# Altium schematic sheet Connector.SchDoc
size A4; SheetNumber: 5; SheetTotal: 4
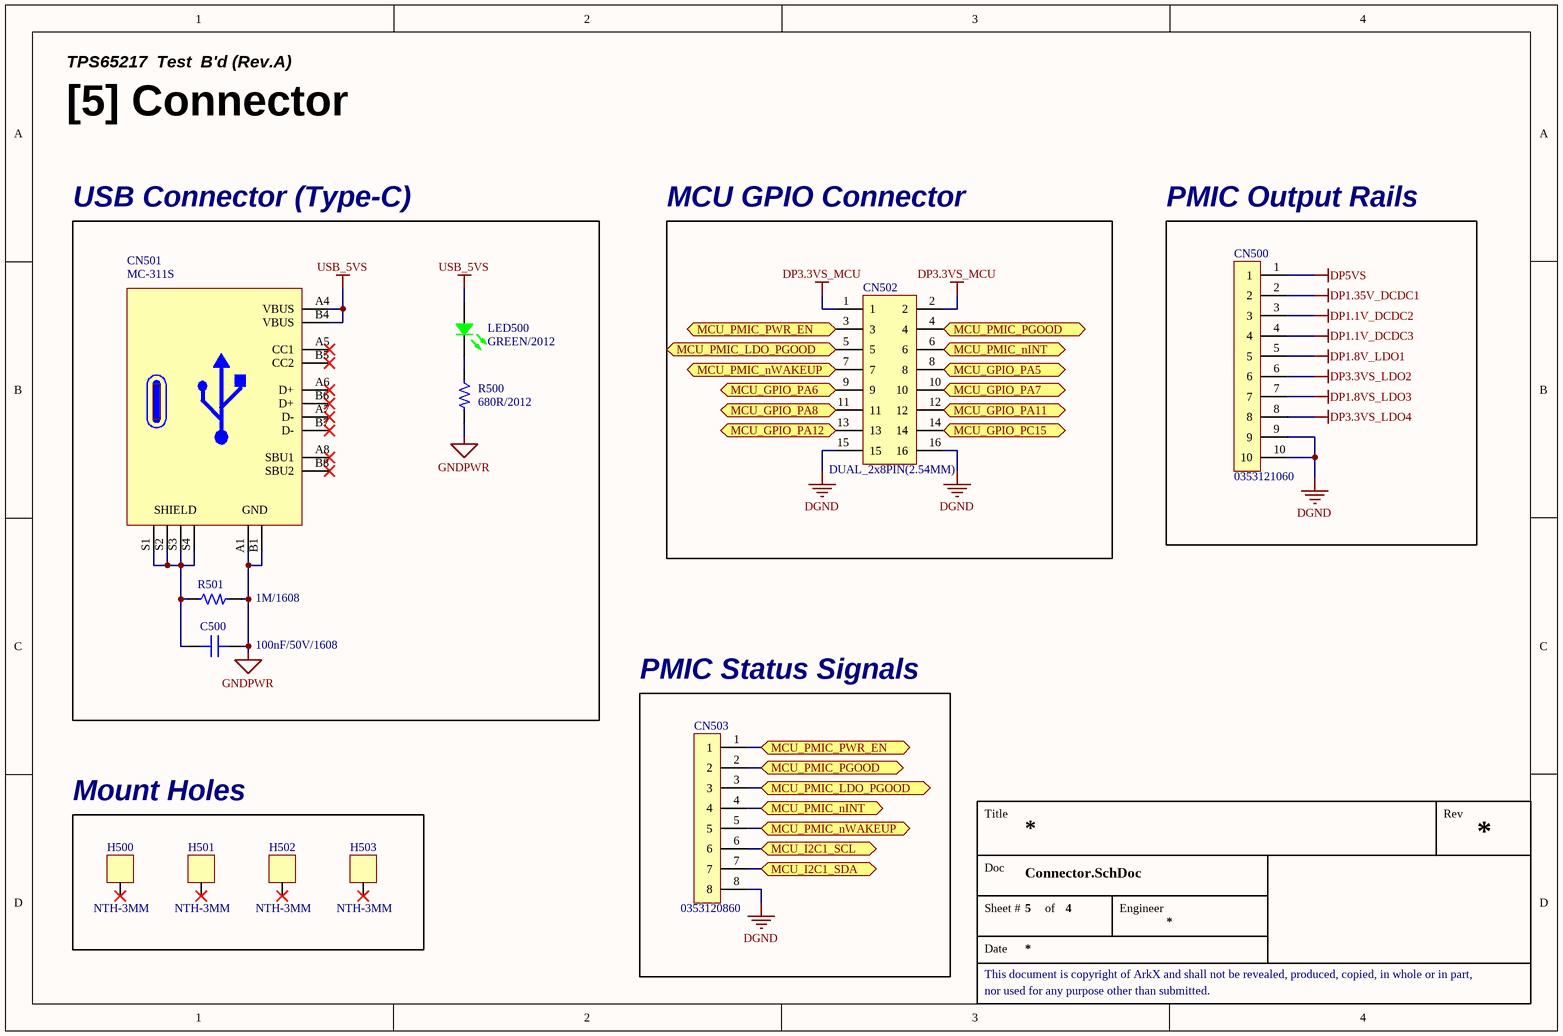
[diagram p0: Connector.SchDoc]

## Parts
C500  100nF/50V/1608  [CAP 1608 (0603_INCH)]
CN500  0353121060  [CON 0353121060 (MOLEX)]
CN501  MC-311S  [CON USB-Type-C (16P)]
CN502  DUAL_2x8PIN(2.54MM)  [CON PIN_HEADER_DUAL_2x8PIN(2.54MM)]
CN503  0353120860  [CON 0353120860 (MOLEX)]
H500  NTH-3MM  [HOLE NTH-3MM]
H501  NTH-3MM  [HOLE NTH-3MM]
H502  NTH-3MM  [HOLE NTH-3MM]
H503  NTH-3MM  [HOLE NTH-3MM]
LED500  GREEN/2012  [LED MHT170RGBCT (GREEN)]
R500  680R/2012  [RES 2012 (0805_inch)]
R501  1M/1608  [RES 1608 (0603_inch)]

## Blocks framed on the sheet
USB Connector (Type-C): C500 CN501 LED500 R500 R501
MCU GPIO Connector: CN502
PMIC Output Rails: CN500
PMIC Status Signals: CN503
Mount Holes: H500-H503

## Ports
MCU_GPIO_PA5 (bidir), MCU_GPIO_PA6 (bidir), MCU_GPIO_PA7 (bidir), MCU_GPIO_PA8 (bidir), MCU_GPIO_PA11 (bidir), MCU_GPIO_PA12 (bidir), MCU_GPIO_PC15 (bidir), MCU_I2C1_SCL (bidir), MCU_I2C1_SDA (bidir), MCU_PMIC_LDO_PGOOD (bidir), MCU_PMIC_nINT (bidir), MCU_PMIC_nWAKEUP (bidir), MCU_PMIC_PGOOD (bidir), MCU_PMIC_PWR_EN (bidir)

## Nets
DGND: CN500.9 CN500.10 CN502.15 CN502.16 CN503.8
DP1.1V_DCDC2: CN500.3
DP1.1V_DCDC3: CN500.4
DP1.8V_LDO1: CN500.5
DP1.8VS_LDO3: CN500.7
DP1.35V_DCDC1: CN500.2
DP3.3VS_LDO2: CN500.6
DP3.3VS_LDO4: CN500.8
DP3.3VS_MCU: CN502.1 CN502.2
DP5VS: CN500.1
GNDPWR: C500.2 CN501.A1(GND) CN501.B1(GND) R500.2 R501.2
USB_5VS: CN501.A4(VBUS) CN501.B4(VBUS) LED500.4(Common_Anode)
MCU_GPIO_PA5: CN502.8 ; port MCU_GPIO_PA5
MCU_GPIO_PA6: CN502.9 ; port MCU_GPIO_PA6
MCU_GPIO_PA7: CN502.10 ; port MCU_GPIO_PA7
MCU_GPIO_PA8: CN502.11 ; port MCU_GPIO_PA8
MCU_GPIO_PA11: CN502.12 ; port MCU_GPIO_PA11
MCU_GPIO_PA12: CN502.13 ; port MCU_GPIO_PA12
MCU_GPIO_PC15: CN502.14 ; port MCU_GPIO_PC15
MCU_I2C1_SCL: CN503.6 ; port MCU_I2C1_SCL
MCU_I2C1_SDA: CN503.7 ; port MCU_I2C1_SDA
MCU_PMIC_LDO_PGOOD: CN502.5 CN503.3 ; port MCU_PMIC_LDO_PGOOD
MCU_PMIC_nINT: CN502.6 CN503.4 ; port MCU_PMIC_nINT
MCU_PMIC_nWAKEUP: CN502.7 CN503.5 ; port MCU_PMIC_nWAKEUP
MCU_PMIC_PGOOD: CN502.4 CN503.2 ; port MCU_PMIC_PGOOD
MCU_PMIC_PWR_EN: CN502.3 CN503.1 ; port MCU_PMIC_PWR_EN
NetC500_1: C500.1 CN501.S1(SHIELD) CN501.S2(SHIELD) CN501.S3(SHIELD) CN501.S4(SHIELD) R501.1
NetLED500_2: LED500.2(GREEN) R500.1

Not connected (* = marked no-connect by the designer): CN501 A5(CC1)* A6(D+)* A7(D-)* A8(SBU1)* B5(CC2)* B6(D+)* B7(D-)* B8(SBU2)*; H500 1*; H501 1*; H502 1*; H503 1*

## Notes on the sheet
- TPS65217  Test  B'd (Rev.A)
- [5] Connector
- Title
- Rev
- Doc
- Sheet #
- of
- Engineer
- This document is copyright of ArkX and shall not be revealed, produced, copied, in whole or in part,
- Date
- nor used for any purpose other than submitted.

## Library data of the parts
C500 = CAP_100nF/50V/1608: Ceramic CAP_100nF/50V/1608; LCSC Part #: C14663; JLCPCB Part Type: Basic Part
CN500 = CON_0353121060: CONN HEADER VERT 10POS 2.5MM
CN501 = CON_USB-Type-C: USB 2.0 5A 1 Surface Mount 16 Female -35℃~+75℃ Type-C SMD  USB Connectors ROHS; LCSC Part #: C2977718; JLCPCB Part Type: Extended Part
CN502 = CON_PIN_HEADER_DUAL_2x8PIN(2.54MM): PIN_HEADER_DUAL_2x8PIN(2.54MM)
CN503 = CON_0353120860: CONN HEADER VERT 8POS 2.5MM
H500-H503 = HOLE_NTH-3MM: Non-Through Hole 3mm
LED500 = LED_MHT170RGBCT(GREEN): Colorless transparence -30℃~+85℃ Positive post Common anode RGB 120° 0805  Light Emitting Diodes (LED) ROHS; LCSC Part #: C2962094; JLCPCB Part Type: Extended Part
R500 = RES_680R/2012/0.125W: Value: 680R; Power Rating: 0.125W; Precision: 1%; Size: 2012; LCSC Part #: C17798; JLCPCB Part Type: Basic Part
R501 = RES_1M/1608/0.1W: Value: 1M; Power Rating: 0.1W; Precision: 1%; Size: 1608; LCSC Part #: C22935; JLCPCB Part Type: Basic Part